# EAGLE design EchtzeitHat (EAGLE 9.3.0)
CREVISION: 2.1
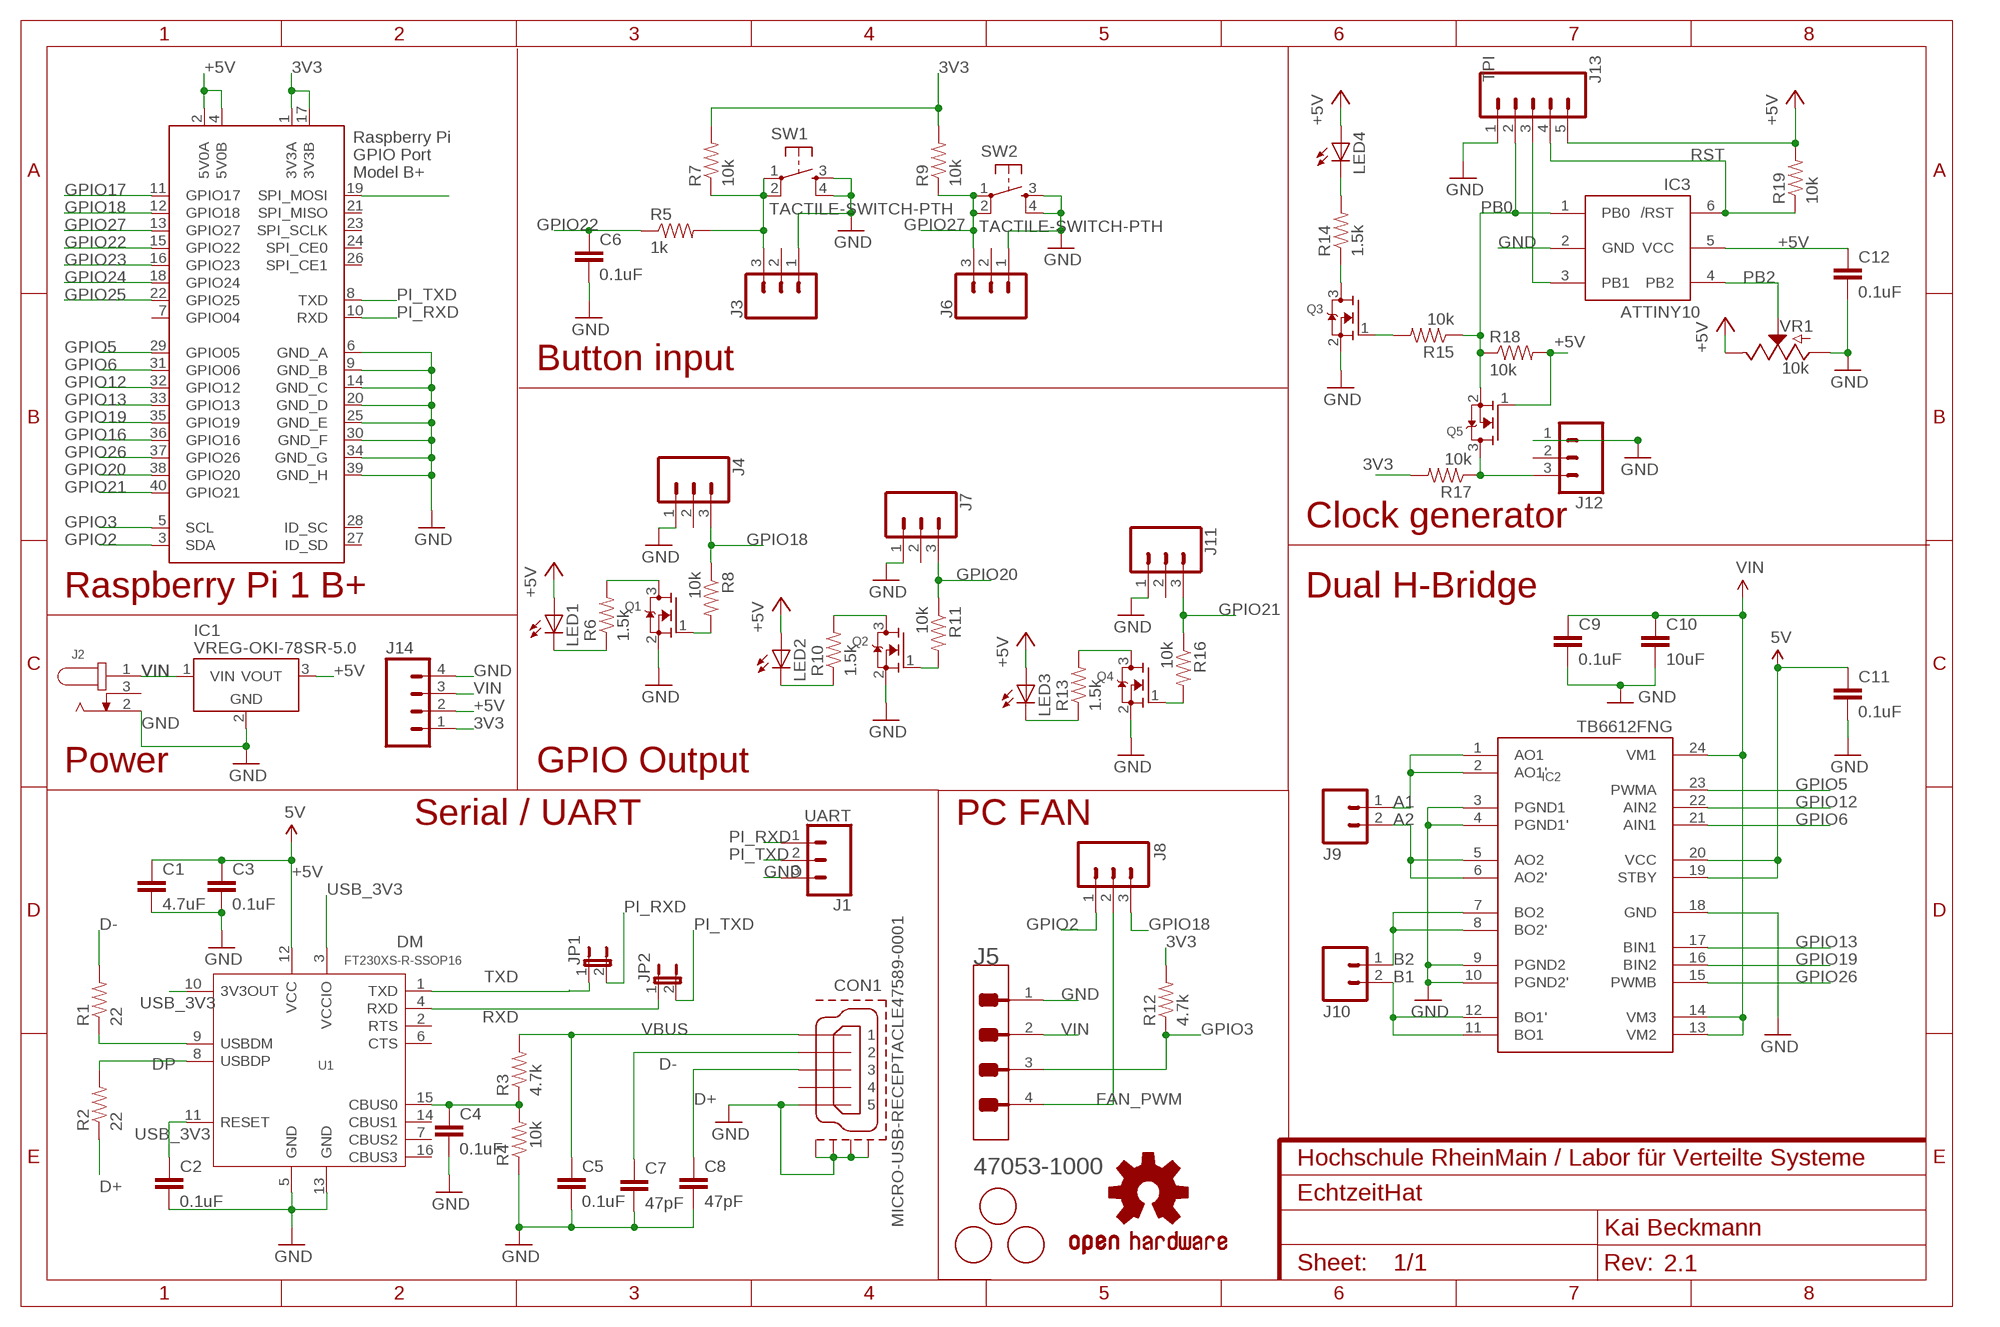
[diagram p0: schematic, sheet 1]
FRAME1 (FRAME-A4L): CNAME: Hochschule RheinMain / Labor für Verteilte Systeme; DESIGNER: Kai Beckmann

## Parts
C1  4.7uF  1.0UF-25V-+80/-20(0805)"  [0805-CAP]
C2  0.1uF  1.0UF-25V-+80/-20(0805)"  [0805-CAP]
C3  0.1uF  1.0UF-25V-+80/-20(0805)"  [0805-CAP]
C4  0.1uF  1.0UF-25V-+80/-20(0805)"  [0805-CAP]
C5  0.1uF  1.0UF-25V-+80/-20(0805)"  [0805-CAP]
C6  0.1uF  1.0UF-25V-+80/-20(0805)"  [0805-CAP]
C7  47pF  1.0UF-25V-+80/-20(0805)"  [0805-CAP]
C8  47pF  1.0UF-25V-+80/-20(0805)"  [0805-CAP]
C9  0.1uF  1.0UF-25V-+80/-20(0805)"  [0805-CAP]
C10  10uF  1.0UF-25V-+80/-20(0805)"  [0805-CAP]
C11  0.1uF  1.0UF-25V-+80/-20(0805)"  [0805-CAP]
C12  0.1uF  1.0UF-25V-+80/-20(0805)"  [0805-CAP]
CON1  MICRO-USB-RECEPTACLE47589-0001  [47589-0001]
FI1  FIDUCIAL  [FIDUCIAL_1MM]
FI2  FIDUCIAL  [FIDUCIAL_1MM]
FI3  FIDUCIAL  [FIDUCIAL_1MM]
IC1  VREG-OKI-78SR-5.0  VREG-OKI-78SR-5.0/1.5-W36H  [OKI-78SR-H]
IC2  TB6612FNG  [SSOP24]
IC3  ATTINY10  [SOT23-6]
J1  UART  CONN_03LOCK  [1X03_LOCK]
J2  PJ-102A  [CUI_PJ-102A]
J3  CONN_03LOCK  [1X03_LOCK]
J4  CONN_03LOCK  [1X03_LOCK]
J5  MOLEX_47053-1000MOLEX_47053-1000_0_0  [MOLEX_47053-1000_0]
J6  CONN_03LOCK  [1X03_LOCK]
J7  CONN_03LOCK  [1X03_LOCK]
J8  M03LOCK  [1X03_LOCK]
J9  M023.5MM_LOCK  [SCREWTERMINAL-3.5MM-2_LOCK]
J10  M023.5MM_LOCK  [SCREWTERMINAL-3.5MM-2_LOCK]
J11  CONN_03LOCK  [1X03_LOCK]
J12  CONN_03LOCK  [1X03_LOCK]
J13  TPI  CONN_05LOCK  [1X05_LOCK]
J14  M04LOCK  [1X04_LOCK]
JP1  JUMPER-2SMD-NC  [SJ_2S]
JP2  JUMPER-2SMD-NC  [SJ_2S]
LED1  LEDCHIPLED_0805  [CHIPLED_0805]
LED2  LEDCHIPLED_0805  [CHIPLED_0805]
LED3  LEDCHIPLED_0805  [CHIPLED_0805]
LED4  LEDCHIPLED_0805  [CHIPLED_0805]
LOGO1  OSHW-LOGOL  [OSHW-LOGO-L]
Q1  MOSFET-NREFLOW  [SOT23]
Q2  MOSFET-NREFLOW  [SOT23]
Q3  MOSFET-NREFLOW  [SOT23]
Q4  MOSFET-NREFLOW  [SOT23]
Q5  MOSFET-NREFLOW  [SOT23]
R1  22  0.22OHM-1/4W-1%(0805)  [0805]
R2  22  0.22OHM-1/4W-1%(0805)  [0805]
R3  4.7k  0.22OHM-1/4W-1%(0805)  [0805]
R4  10k  0.22OHM-1/4W-1%(0805)  [0805]
R5  1k  0.22OHM-1/4W-1%(0805)  [0805]
R6  1.5k  0.22OHM-1/4W-1%(0805)  [0805]
R7  10k  0.22OHM-1/4W-1%(0805)  [0805]
R8  10k  0.22OHM-1/4W-1%(0805)  [0805]
R9  10k  0.22OHM-1/4W-1%(0805)  [0805]
R10  1.5k  0.22OHM-1/4W-1%(0805)  [0805]
R11  10k  0.22OHM-1/4W-1%(0805)  [0805]
R12  4.7k  0.22OHM-1/4W-1%(0805)  [0805]
R13  1.5k  0.22OHM-1/4W-1%(0805)  [0805]
R14  1.5k  0.22OHM-1/4W-1%(0805)  [0805]
R15  10k  0.22OHM-1/4W-1%(0805)  [0805]
R16  10k  0.22OHM-1/4W-1%(0805)  [0805]
R17  10k  0.22OHM-1/4W-1%(0805)  [0805]
R18  10k  0.22OHM-1/4W-1%(0805)  [0805]
R19  10k  0.22OHM-1/4W-1%(0805)  [0805]
SW1  TACTILE-SWITCH-PTH  [TAC-SWITCH-PTH]
SW2  TACTILE-SWITCH-PTH  [TAC-SWITCH-PTH]
U1  FT230XS-R-SSOP16  INTERFACE-FT230XS-R(SSOP16)  [SSOP16-0.635-5X4MM]
VR1  10k  POTENTIOMETER-PTH-9MM-1/20W-20%-KIT  [POT-PTH-ALPS-KIT]
X1  RASPI_BOARD_B+#_H  [RASPI_BOARD_B+HAT]

## Nets
3V3: J14.1 R7.2 R9.2 R12.2 R17.2 X1.1(3V3A) X1.17(3V3B)
+5V: C1.1 C3.1 C11.1 C12.1 IC1.3(VOUT) IC2.19(STBY) IC2.20(VCC) IC3.5(VCC) J13.5 J14.2 LED1.A LED2.A LED3.A LED4.A Q5.1(G) R18.2 R19.2 U1.12(VCC) VR1.P$1(E) X1.2(5V0A) X1.4(5V0B) ; supply symbol labelled 5V
A1: IC2.1(AO1) IC2.2(AO1') J9.1
A2: IC2.5(AO2) IC2.6(AO2') J9.2
B1: IC2.11(BO1) IC2.12(BO1') J10.2
B2: IC2.7(BO2) IC2.8(BO2') J10.1
CBUS: C4.1 R3.1 R4.2 U1.15(CBUS0)
D+: C8.1 CON1.3 R2.1
D-: C7.1 CON1.2 R1.2
DM: R1.1 U1.9(USBDM)
DP: R2.2 U1.8(USBDP)
FAN_PWM: J5.4 J8.2
GND: C1.2 C2.2 C3.2 C4.2 C5.2 C6.2 C7.2 C8.2 C9.2 C10.2 C11.2 C12.2 CON1.5 CON1.CASING1(GND1) CON1.CASING2(GND2) CON1.CASING3(GND3) CON1.CASING4(GND4) IC1.2(GND) IC2.3(PGND1) IC2.4(PGND1') IC2.9(PGND2) IC2.10(PGND2') IC2.18(GND) IC3.2(GND) J1.3 J2.2 J3.1 J4.1 J5.1 J6.1 J7.1 J11.1 J12.1 J13.1 J14.4 Q1.2(S) Q2.2(S) Q3.2(S) Q4.2(S) R4.1 SW1.3 SW1.4 SW2.3 SW2.4 U1.5(GND) U1.13(GND) VR1.P$3(A) X1.6(GND_A) X1.9(GND_B) X1.14(GND_C) X1.20(GND_D) X1.25(GND_E) X1.30(GND_F) X1.34(GND_G) X1.39(GND_H)
GPIO2: J8.1 X1.3(SDA)
GPIO3: J5.3 R12.1 X1.5(SCL)
GPIO5: IC2.23(PWMA) X1.29(GPIO05)
GPIO6: IC2.21(AIN1) X1.31(GPIO06)
GPIO12: IC2.22(AIN2) X1.32(GPIO12)
GPIO13: IC2.17(BIN1) X1.33(GPIO13)
GPIO16: X1.36(GPIO16)
GPIO17: X1.11(GPIO17)
GPIO18: J4.3 J8.3 R8.1 X1.12(GPIO18)
GPIO19: IC2.16(BIN2) X1.35(GPIO19)
GPIO20: J7.3 R11.1 X1.38(GPIO20)
GPIO21: J11.3 R16.1 X1.40(GPIO21)
GPIO22: C6.1 R5.1 X1.15(GPIO22)
GPIO23: X1.16(GPIO23)
GPIO24: X1.18(GPIO24)
GPIO25: X1.22(GPIO25)
GPIO26: IC2.15(PWMB) X1.37(GPIO26)
GPIO27: J6.3 R9.1 SW2.1 SW2.2 X1.13(GPIO27)
N$2: LED1.C R6.1
N$3: IC3.3(PB1) J13.3
N$4: Q1.3(D) R6.2
N$6: Q1.1(G) R8.2
N$14: X1.19(SPI_MOSI)
N$17: LED4.C R14.2
N$18: Q3.3(D) R14.1
N$19: Q3.1(G) R15.2
N$20: J3.3 R5.2 R7.1 SW1.1 SW1.2
N$24: LED2.C R10.1
N$25: Q2.3(D) R10.2
N$26: Q2.1(G) R11.2
N$28: LED3.C R13.1
N$29: Q4.3(D) R13.2
N$30: Q4.1(G) R16.2
OSC: J12.3 Q5.3(D) R17.1
PB0: IC3.1(PB0) J13.2 Q5.2(S) R15.1 R18.1
PB2: IC3.4(PB2) VR1.P$2(S)
PI_RXD: J1.1 JP1.2 X1.10(RXD)
PI_TXD: J1.2 JP2.2 X1.8(TXD)
RST: IC3.6(/RST) J13.4 R19.1
RXD: JP2.1 U1.4(RXD)
TXD: JP1.1 U1.1(TXD)
USB_3V3: C2.1 U1.3(VCCIO) U1.10(3V3OUT) U1.11(RESET)
VBUS: C5.1 CON1.1 R3.2
VIN: C9.1 C10.1 IC1.1(VIN) IC2.13(VM2) IC2.14(VM3) IC2.24(VM1) J2.1 J5.2 J14.3
Unconnected: CON1.4 J2.3 J3.2 J4.2 J6.2 J7.2 J11.2 J12.2 U1.2(RTS) U1.6(CTS) U1.7(CBUS2) U1.14(CBUS1) U1.16(CBUS3) X1.7(GPIO04) X1.21(SPI_MISO) X1.23(SPI_SCLK) X1.24(SPI_CE0) X1.26(SPI_CE1) X1.27(ID_SD) X1.28(ID_SC)

## Notes on the sheet
- Button input
- Clock generator
- Raspberry Pi 1 B+ | Dual H-Bridge
- Power | GPIO Output
- Serial / UART | PC FAN

## Library data of the parts
C1-C12 = SparkFun-Capacitors:1.0UF-25V-+80/-20(0805): CAP-11625; PROD_ID: CAP-11625; VALUE: 1.0uF
CON1 = con-molex-usb:MICRO-USB-RECEPTACLE: MICRO USB RECEPTACLES Micro-USB Receptacles, SMT, Lead-Free from MOLEX <http://www.molex.com/>. (C) 2014 Tomasz Boleslaw CEDRO, cederom@tlen.pl, http://www.tomek.cedro.info. Version 0.1 (2014-01-17): Initial release. Version 0.2 (2014-02-06): Updated 47589-0001 footprint pins/pads/milling. Following devices are included: 1. 47589-0001 Micro-USB AB Receptacle, Bottom Mount, SMT, Lead-Free <http://www.molex.com/molex/products/datasheet.jsp?part=active/0475890001_IO_CONNECTORS.xml> (Technical Drawing <http://www.molex.com/pdm_docs/sd/475890001_sd.pdf>).
FI1-FI3 = adafruit:FIDUCIAL: For use by pick and place machines to calibrate the vision/machine, 1mm By microbuilder.eu
IC1 = we-power:VREG: Voltage Regulator LDOs Taiwan Semi TS1117 800mA max 15V - compatible On Semi NCP1117 1A max 20V - compatible Diodes AP2111H 0.6A max 6V (0.25V@0.6A) - compatible Diodes AP2114H 1A max 6V (0.45V@1A) Taiwan Semi TS9011 250mA max 12V - compatible Diodes AP2210 300mA max 15V - compatible Microchip MCP1700 250mA max 6.5V - compatible Microchip MCP1702 250mA max 13V - compatible Microchip MCP1703 250mA max 16V - compatible Microchip MCP1754 150mA max 16V Taiwan Semi TS5204 80mA max 16V (low noise) DC/DC Converter Modules Recom R-78Ex.x-1.0-W36 1A max 28V - compatible CUI V78xx-2000 2A max 18V Murata OKI-78SR-x.x/1.5-W36 1.5A max 36V
IC2 = adafruit:TB6612FNG: TB6612FNG MOS dual H-bridge motor driver, 1.2A current 3.2A peak 3 or 5v logic and 3-15v motor
IC3 = adafruit:ATTINY10: ATtiny4/5/9/10 8-bit Microcontroller with 512/1024 Bytes In-System Programmable Flash
J1 J3 J4 J6 J7 J11 J12 = SparkFun-Connectors:CONN_03: Multi connection point. Often used as Generic Header-pin footprint for 0.1 inch spaced/style header connections On any of the 0.1 inch spaced packages, you can populate with these: Break Away Headers - Straight <https://www.sparkfun.com/products/116> (PRT-00116) Break Away Male Headers - Right Angle <https://www.sparkfun.com/products/553> (PRT-00553) Female Headers <https://www.sparkfun.com/products/115> (PRT-00115) Break Away Headers - Machine Pin <https://www.sparkfun.com/products/117> (PRT-00117) Break Away Female Headers - Swiss Machine Pin <https://www.sparkfun.com/products/743> (PRT-00743) Stackable Header - 3 Pin (Female, 0.1") <https://www.sparkfun.com/products/13875> (PRT-13875) For SCREWTERMINALS and SPRING TERMINALS visit here: Screw Terimnals on SparkFun.com <https://www.sparkfun.com/search/results?term=Screw+Terminals> (5mm/3.5mm/2.54mm spacing) This device is also useful as a general connection point to wire up your design to another part of your project. Our various solder wires solder well into these plated through hole pads. Hook-Up Wire - Assortment (Stranded, 22 AWG) <https://www.sparkfun.com/products/11375> (PRT-11375) Hook-Up Wire - Assortment (Solid Core, 22 AWG) <https://www.sparkfun.com/products/11367> (PRT-11367) View the entire wire category on our website here <https://www.sparkfun.com/categories/141> Special notes: Molex polarized connector foot print use with SKU : PRT-08232 with associated crimp pins and housings.
J2 = PJ-102A:PJ-102A: 2.0 mm Center Pin, 2.5 A, Right Angle, Through Hole, Tapered Pins, Dc Power Jack Connector; MANUFACTURER: CUI INC; PART_REV: 1.03; STANDARD: Manufacturer recommendations
J5 = Molex - 47053-1000:MOLEX_47053-1000: 4-PIN HEADER HOUSING WITH FRICTION LOCK; CENTROID_NOT_SPECIFIED: Yes; CONTACT_TYPE: Male Pin; CURRENT: 4.0A; DATASHEET: http://www.molex.com/webdocs/datasheets/pdf/en-us//0470531000_PCB_HEADERS.pdf; DIGIKEY_DESCRIPTION: CONN 4 Positions Header, Unshrouded Connector 0.100" (2.54mm) Through Hole Tin; DIGIKEY_PART_NUMBER: WM4330-ND; IPC_LAND_PATTERN_NAME: HDRV4W65P_1X4_1020X65X1350; LEAD_FREE: yes; MF: Molex; MOUNTING_STYLE: Through Hole; MOUSER_PART_NUMBER: 538-47053-1000; MPN: 47053-1000; PACKAGE: CONN_4P254L; PITCH: 2.54mm; PREFIX: J; ROHS: yes; TEMPERATURE_RANGE_HIGH: +75°C; TEMPERATURE_RANGE_LOW: 0°C; VOLTAGE: 250V
J8 = SparkFun-Connectors:M03: Header 3 Standard 3-pin 0.1" header. Use with straight break away headers (SKU : PRT-00116), right angle break away headers (PRT-00553), swiss pins (PRT-00743), machine pins (PRT-00117), and female headers (PRT-00115). Molex polarized connector foot print use with SKU : PRT-08232 with associated crimp pins and housings.
J9 J10 = SparkFun-Connectors:M02: Standard 2-pin 0.1" header. Use with - straight break away headers ( PRT-00116) - right angle break away headers (PRT-00553) - swiss pins (PRT-00743) - machine pins (PRT-00117) - female headers (PRT-00115) Molex polarized connector foot print use with: PRT-08233 with associated crimp pins and housings. 2.54_SCREWTERM for use with PRT-10571. 3.5mm Screw Terminal footprints for PRT-08084 5mm Screw Terminal footprints for use with PRT-08432; PROD_ID: CONN-08399
J13 = SparkFun-Connectors:CONN_05: Multi connection point. Often used as Generic Header-pin footprint for 0.1 inch spaced/style header connections On any of the 0.1 inch spaced packages, you can populate with these: Break Away Headers - Straight <https://www.sparkfun.com/products/116> (PRT-00116) Break Away Male Headers - Right Angle <https://www.sparkfun.com/products/553> (PRT-00553) Female Headers <https://www.sparkfun.com/products/115> (PRT-00115) Break Away Headers - Machine Pin <https://www.sparkfun.com/products/117> (PRT-00117) Break Away Female Headers - Swiss Machine Pin <https://www.sparkfun.com/products/743> (PRT-00743) For SCREWTERMINALS and SPRING TERMINALS visit here: Screw Terimnals on SparkFun.com <https://www.sparkfun.com/search/results?term=Screw+Terminals> (5mm/3.5mm/2.54mm spacing) This device is also useful as a general connection point to wire up your design to another part of your project. Our various solder wires solder well into these plated through hole pads. Hook-Up Wire - Assortment (Stranded, 22 AWG) <https://www.sparkfun.com/products/11375> (PRT-11375) Hook-Up Wire - Assortment (Solid Core, 22 AWG) <https://www.sparkfun.com/products/11367> (PRT-11367) View the entire wire category on our website here <https://www.sparkfun.com/categories/141> Special notes: Molex polarized connector foot print use with SKU : PRT-08231 with associated crimp pins and housings. 1MM SMD Version SKU: PRT-10208
J14 = SparkFun-Connectors:M04: Header 4 Standard 4-pin 0.1" header. Use with straight break away headers (SKU : PRT-00116), right angle break away headers (PRT-00553), swiss pins (PRT-00743), machine pins (PRT-00117), and female headers (PRT-00115). Molex polarized connector foot print use with SKU : PRT-08231 with associated crimp pins and housings. 1MM SMD Version SKU: PRT-10208; PROD_ID: CONN-09696
JP1 JP2 = SparkFun-Retired:JUMPER-2: Jumper Basic 0.1" spaced jumper. Use with breakaway headers.
LED1-LED4 = adafruit:LED: LED OSRAM: - CHIPLED LG R971, LG N971, LY N971, LG Q971, LY Q971, LO R971, LY R971 LH N974, LH R974 LS Q976, LO Q976, LY Q976 LO Q996 - Hyper CHIPLED LW Q18S LB Q993, LB Q99A, LB R99A - SideLED LS A670, LO A670, LY A670, LG A670, LP A670 LB A673, LV A673, LT A673, LW A673 LH A674 LY A675 LS A676, LA A676, LO A676, LY A676, LW A676 LS A679, LY A679, LG A679 - Hyper Micro SIDELED® LS Y876, LA Y876, LO Y876, LY Y876 LT Y87S - SmartLED LW L88C, LW L88S LB L89C, LB L89S, LG L890 LS L89K, LO L89K, LY L89K LS L896, LA L896, LO L896, LY L896 - TOPLED LS T670, LO T670, LY T670, LG T670, LP T670 LSG T670, LSP T670, LSY T670, LOP T670, LYG T670 LG T671, LOG T671, LSG T671 LB T673, LV T673, LT T673, LW T673 LH T674 LS T676, LA T676, LO T676, LY T676, LB T676, LH T676, LSB T676, LW T676 LB T67C, LV T67C, LT T67C, LS T67K, LO T67K, LY T67K, LW E67C LS E67B, LA E67B, LO E67B, LY E67B, LB E67C, LV E67C, LT E67C LW T67C LS T679, LY T679, LG T679 LS T770, LO T770, LY T770, LG T770, LP T770 LB T773, LV T773, LT T773, LW T773 LH T774 LS E675, LA E675, LY E675, LS T675 LS T776, LA T776, LO T776, LY T776, LB T776 LHGB T686 LT T68C, LB T68C - Hyper Mini TOPLED® LB M676 - Mini TOPLED Santana® LG M470 LS M47K, LO M47K, LY M47K Source: http://www.osram.convergy.de/
LOGO1 = SparkFun-Aesthetics:OSHW-LOGO: Open Source Hardware Logo This logo indicates the piece of hardware it is found on incorporates a OSHW license and/or adheres to the definition of open source hardware found here: http://freedomdefined.org/OSHW
Q1-Q5 = adafruit:MOSFET-N: N-Channel Mosfet 2N7002E - 60V 260mA SOT23 [Digikey: 2N7002ET1GOSTR-ND] - REEL BSH103 - 30V 850mA SOT23 [Digikey: 568-5013-1-ND]
R1-R19 = SparkFun-Resistors:0.22OHM-1/4W-1%(0805): RES-09883; PROD_ID: RES-09883; VALUE: 0.22
SW1 SW2 = GeekAmmo:TACTILE-SWITCH: Tactile Switch 4 Pins, SPST NO
U1 = Seeed-IC:INTERFACE-FT230XS-R(SSOP16): 310070030; MPN: FT230XS-R
VR1 = SparkFun-Resistors:POTENTIOMETER: Potentiometer (Pot) Three-terminal potentiometers, with an adjustable wiper and two adjustable resistors. A pot can be used to create a configurable voltage divider, or as a variable resistor. Variants ALPS_POT and ALPS_POT_KIT - PTH, breadboard compatible, 9mm square pots Rotary Potentiometer - Linear (10k ohm) <https://www.sparkfun.com/products/9288> (COM-09288) The KIT variant exposes copper on only one side of the PTH pad, so the part can only be assembled on one side of the PCB. Useful for beginner soldering kits.; PROD_ID: RES-09177; SF_SKU: COM-09288
X1 = raspberrypi_bastelstube_v13:RASPI_BOARD_B+#: Raspberry Pi GPIO connector with markings for the outer dimensions of the Raspberry Pi board model B+ with different sets of drill holes or mounting pads All pins connected

## Board
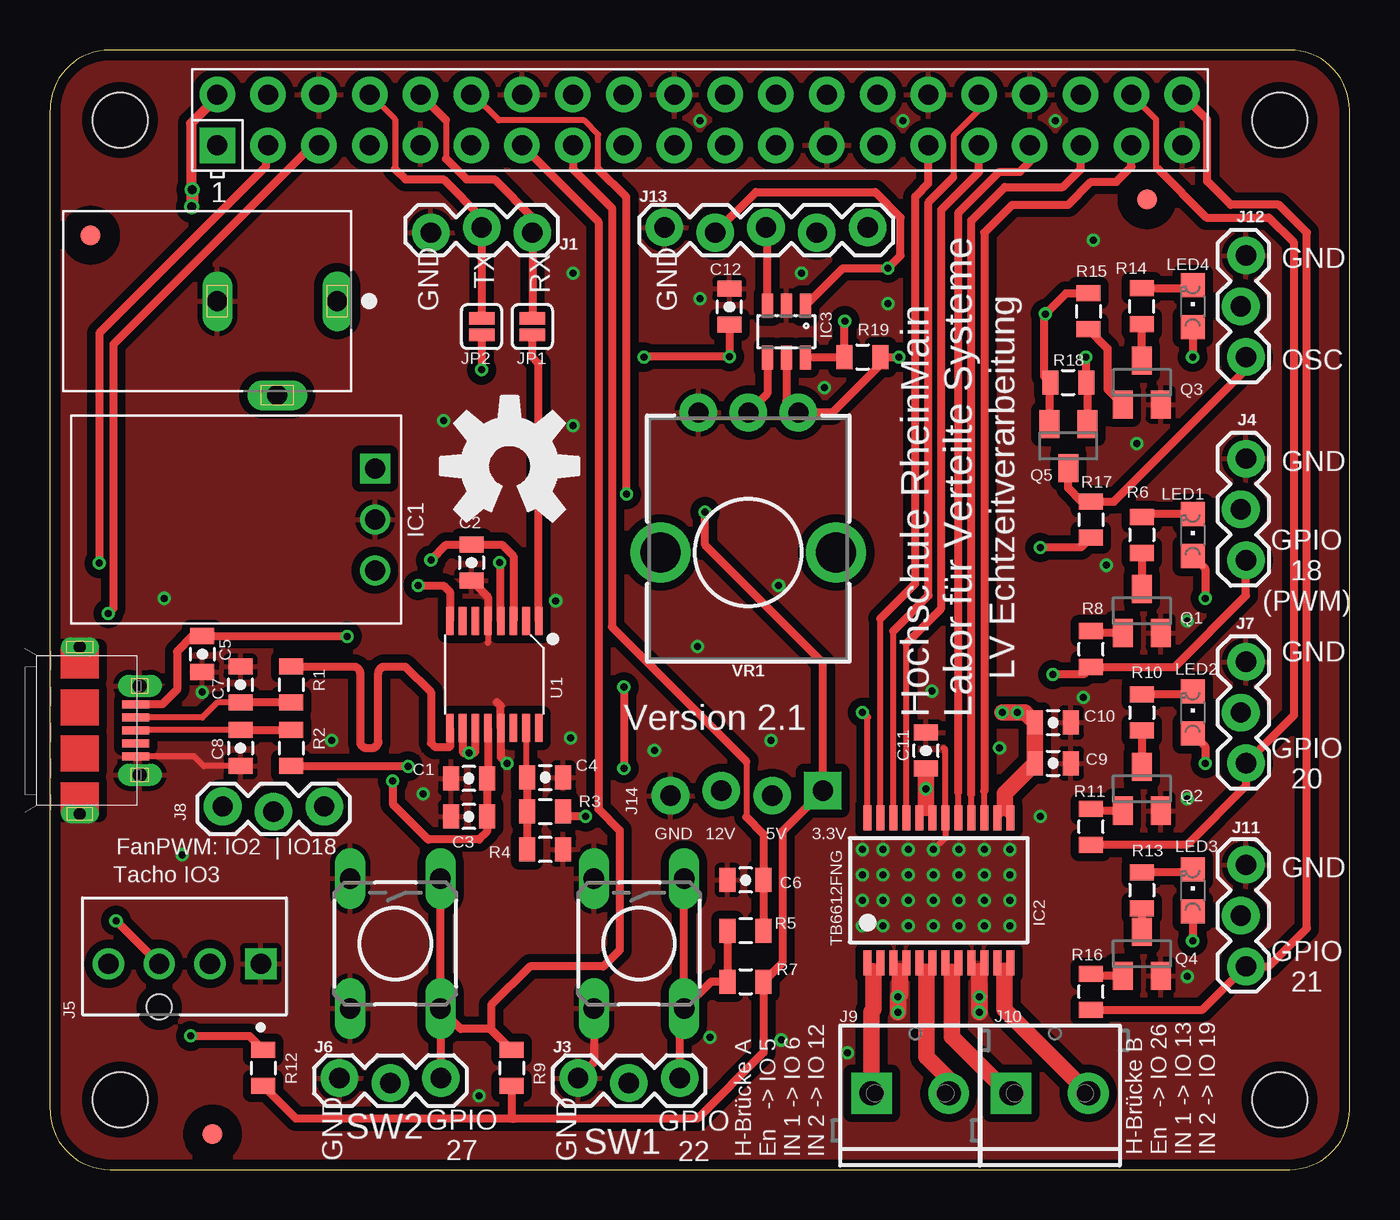
[diagram p1: board, top side]
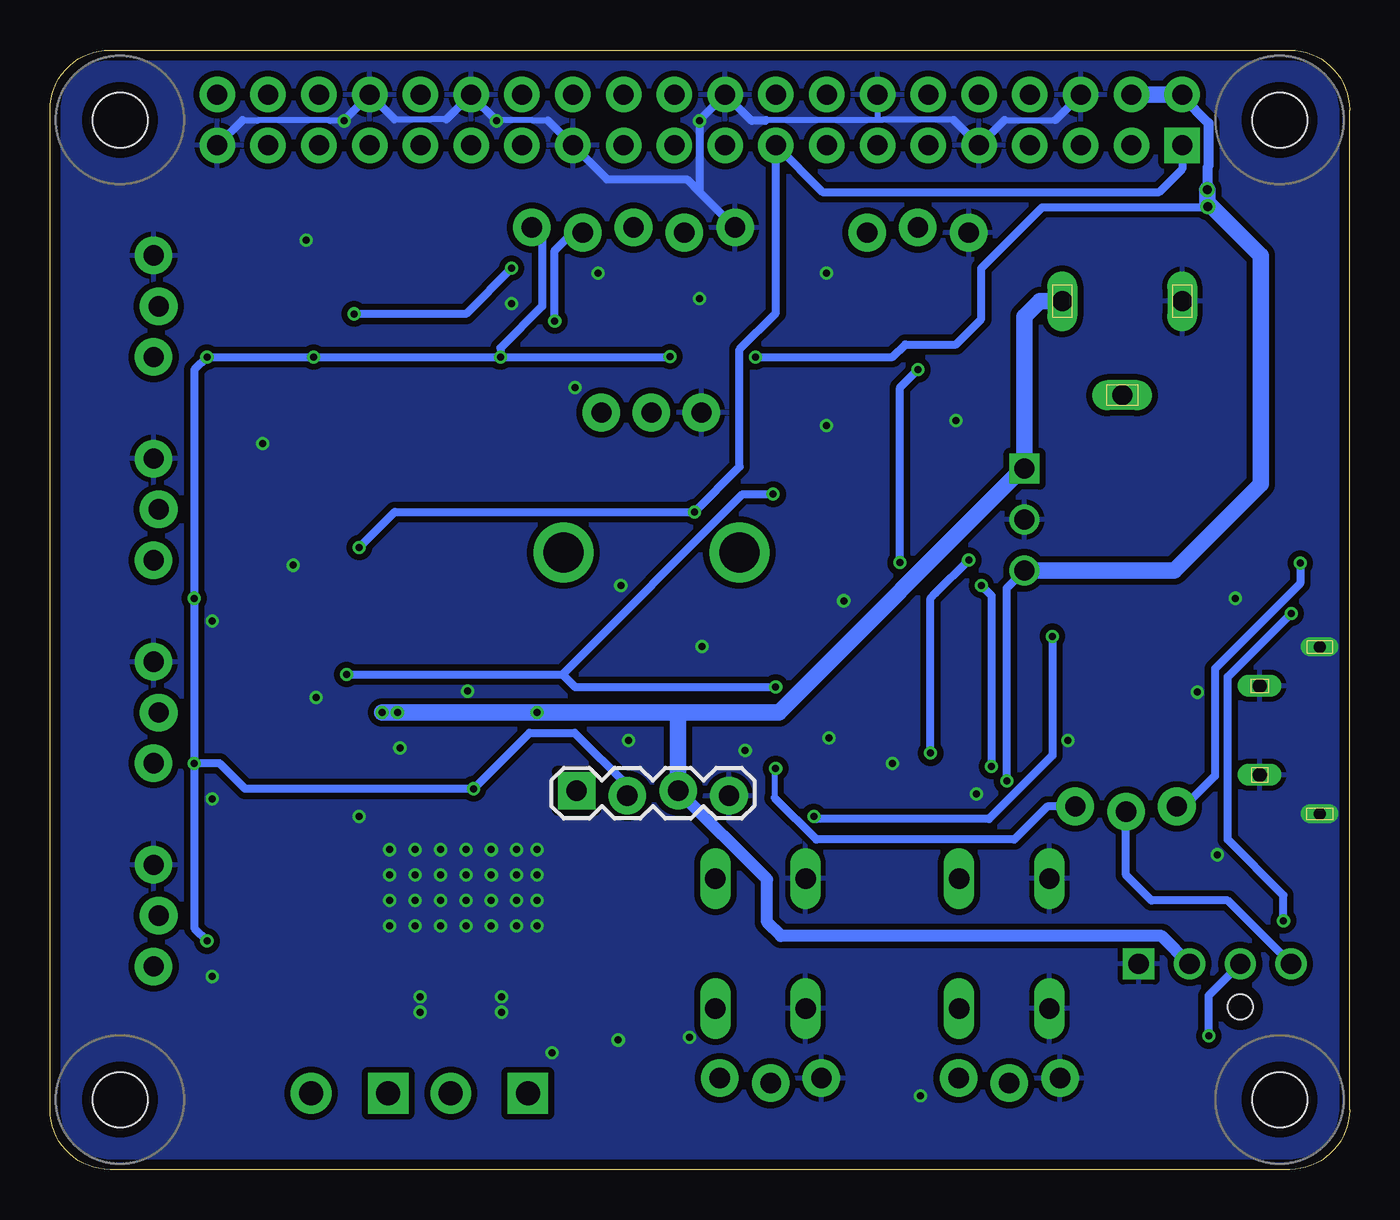
[diagram p2: board, bottom side, seen from below]

Size 65 x 56 mm. Coordinates in mm from the lower left corner, seen from the top.
Copper layers (1*16): Top 0.035mm / dielectric 1.6mm / Bottom 0.035mm
Design rules "Elecrow_2-layer_PCB_eagle_rule *": minimum track width 6mil, minimum drill 12mil, track to track 6mil, track to pad 6mil, pad to pad 6mil, via to via 8mil, smd to smd 0mil, copper to edge 20mil, drill to drill 10mil, minimum pad ring 6mil, minimum via ring 6mil, stop-mask expansion 0mil, vias tented up to drill 100mil, thermal gap 10mil

### Footprints (pad centres in the part's own frame; a part is rotated, then mirrored left to right if it is on the bottom)
0805-CAP = smd 0.8 x 1.2: 1 -0.9,0; 2 0.9,0
47589-0001 = smd 1.35 x 0.4: 1 2.8,1.3; 2 2.8,0.65; 3 2.8,0; 4 2.8,-0.65; 5 2.8,-1.3 | drill 0.6 pad 0.95 long: CASING1 0,4.175; CASING2 0,-4.175 | drill 0.7 pad 1.1 long: CASING3 3,2.225; CASING4 3,-2.225
FIDUCIAL_1MM = smd 1 x 1: 1 0,0
OKI-78SR-H = drill 1 pad 1.5 square: 1 -2.54,0 | drill 1 pad 1.5: 2 0,0; 3 2.54,0
SSOP24 = smd 0.4 x 1.25: 1 -3.575,-3.625; 2 -2.925,-3.625; 3 -2.275,-3.625; 4 -1.625,-3.625; 5 -0.975,-3.625; 6 -0.325,-3.625; 7 0.325,-3.625; 8 0.975,-3.625; 9 1.625,-3.625; 10 2.275,-3.625; 11 2.925,-3.625; 12 3.575,-3.625; 13 3.575,3.625; 14 2.925,3.625; 15 2.275,3.625; 16 1.625,3.625; 17 0.975,3.625; 18 0.325,3.625; 19 -0.325,3.625; 20 -0.975,3.625; 21 -1.625,3.625; 22 -2.275,3.625; 23 -2.925,3.625; 24 -3.575,3.625
SOT23-6 = smd 0.55 x 1.2: 1 -0.95,-1.3; 2 0,-1.3; 3 0.95,-1.3; 4 0.95,1.3; 5 0,1.3; 6 -0.95,1.3
1X03_LOCK = drill 1.016 pad 1.88: 1 0,0.127; 2 2.54,-0.127; 3 5.08,0.127
CUI_PJ-102A = drill 1 long: 1 -6.5,0; 2 -0.5,0; 3 -3.5,4.7
MOLEX_47053-1000_0 = drill 1.02 pad 1.57 square: 1 -0.38,-3.81 | drill 1.02 pad 1.57: 2 -0.38,-1.27; 3 -0.38,1.27; 4 -0.38,3.81 | hole 1.25: -2.54,1.27
SCREWTERMINAL-3.5MM-2_LOCK = drill 1.2 pad 2.032 square: 1 -0.178,0 | drill 1.2 pad 2.032: 2 3.678,0
1X05_LOCK = drill 1.016 pad 1.88: 1 0,0.127; 2 2.54,-0.127; 3 5.08,0.127; 4 7.62,-0.127; 5 10.16,0.127
1X04_LOCK = drill 1.016 pad 1.88 square: 1 0,0.127 | drill 1.016 pad 1.88: 2 2.54,-0.127; 3 5.08,0.127; 4 7.62,-0.127
SJ_2S = smd 0.635 x 1.27: 1 -0.412,0; 2 0.412,0
CHIPLED_0805 = smd 1.2 x 1.2: A 0,-1.05; C 0,1.05
SOT23 = smd 1 x 1.4: 1 -0.95,-1.1; 2 0.95,-1.1; 3 0,1.1
0805 = smd 0.8 x 1.2: 1 -0.9,0; 2 0.9,0
TAC-SWITCH-PTH = drill 1.016 pad 1.524 long: 1 -3.251,2.261; 2 3.251,2.261; 3 -3.251,-2.261; 4 3.251,-2.261
SSOP16-0.635-5X4MM = smd 0.381 x 1.397: 1 -2.223,-2.667; 2 -1.587,-2.667; 3 -0.953,-2.667; 4 -0.318,-2.667; 5 0.318,-2.667; 6 0.953,-2.667; 7 1.587,-2.667; 8 2.223,-2.667; 9 2.223,2.667; 10 1.587,2.667; 11 0.953,2.667; 12 0.318,2.667; 13 -0.318,2.667; 14 -0.953,2.667; 15 -1.587,2.667; 16 -2.223,2.667
POT-PTH-ALPS-KIT = drill 1 pad 1.88: P$1 7,-2.5; P$2 7,0; P$3 7,2.5 | drill 2: P$4 0,-4.4; P$5 0,4.4
RASPI_BOARD_B+HAT = drill 1 pad 1.778 square: 1 8.37,51.23 | drill 1 pad 1.778: 2 8.37,53.77; 3 10.91,51.23; 4 10.91,53.77; 5 13.45,51.23; 6 13.45,53.77; 7 15.99,51.23; 8 15.99,53.77; 9 18.53,51.23; 10 18.53,53.77; 11 21.07,51.23; 12 21.07,53.77; 13 23.61,51.23; 14 23.61,53.77; 15 26.15,51.23; 16 26.15,53.77; 17 28.69,51.23; 18 28.69,53.77; 19 31.23,51.23; 20 31.23,53.77; 21 33.77,51.23; 22 33.77,53.77; 23 36.31,51.23; 24 36.31,53.77; 25 38.85,51.23; 26 38.85,53.77; 27 41.39,51.23; 28 41.39,53.77; 29 43.93,51.23; 30 43.93,53.77; 31 46.47,51.23; 32 46.47,53.77; 33 49.01,51.23; 34 49.01,53.77; 35 51.55,51.23; 36 51.55,53.77; 37 54.09,51.23; 38 54.09,53.77; 39 56.63,51.23; 40 56.63,53.77 | hole 2.75: 3.5,3.5; 3.5,52.5; 61.5,3.5; 61.5,52.5

### Placement (x,y rotation side)
C1  20.95,19.56 180 top
C2  21.08,30.35 270 top
C3  20.95,17.65 180 top
C4  24.77,19.61 0 top
C5  7.62,25.78 270 top
C6  34.8,14.48 180 top
C7  9.53,24.26 90 top
C8  9.53,21.08 270 top
C9  50.16,20.32 0 top
C10  50.16,22.35 0 top
C11  43.81,20.95 90 top
C12  33.99,43.15 90 top
CON1  1.5,21.97 0 top
FI1  54.86,48.51 0 top
FI2  8.13,1.78 0 top
FI3  2.03,46.74 0 top
IC1  16.26,32.51 270 top
IC2  44.45,13.97 0 top
IC3  36.83,41.91 180 top
J1  24.13,46.99 180 top
J2  7.87,43.43 180 top
J3  26.42,4.45 0 top
J4  59.69,35.56 270 top
J5  6.73,10.67 90 top
J6  14.48,4.45 0 top
J7  59.69,25.4 270 top
J8  8.64,18.03 0 top
J9  41.27,3.81 0 top
J10  48.26,3.81 0 top
J11  59.69,15.24 270 top
J12  59.69,45.72 270 top
J13  30.73,46.99 0 top
J14  38.66,18.82 0 bottom
JP1  24.13,42.16 90 top
JP2  21.59,42.16 90 top
LED1  57.15,31.75 0 top
LED2  57.15,22.86 0 top
LED3  57.15,13.97 0 top
LED4  57.15,43.18 0 top
LOGO1  22.99,35.18 0 top
Q1  54.61,27.94 0 top
Q2  54.61,19.05 0 top
Q3  54.61,39.37 0 top
Q4  54.61,10.79 0 top
Q5  50.93,36.2 180 top
R1  12.06,24.26 270 top
R2  12.06,21.08 270 top
R3  24.77,17.91 0 top
R4  24.77,16 180 top
R5  34.8,11.94 180 top
R6  54.61,31.75 270 top
R7  34.8,9.4 0 top
R8  52.07,26.04 90 top
R9  23.09,5.08 270 top
R10  54.61,22.86 270 top
R11  52.07,17.14 90 top
R12  10.67,5.08 270 top
R13  54.61,13.97 270 top
R14  54.61,43.18 90 top
R15  51.94,42.93 270 top
R16  52.07,8.89 90 top
R17  52.07,32.51 270 top
R18  50.93,39.37 0 top
R19  40.64,40.64 0 top
SW1  29.46,11.3 270 top
SW2  17.27,11.3 270 top
U1  22.23,24.77 180 top
VR1  34.92,30.86 90 top
X1  0,0 0 top

### Tracks (layer width: path | path; a pad name or v marks a point on that pad's centre or on a via)
3V3  (via drill 0.35)
  Top 0.406: R17.2 51.57,31.11 v49.53,31.11 | R9.2 23.09,2.54 | 23.09,2.54 22.61,2.54 12.31,2.54 R12.2 | v32.77,32.89 32.77,31.24 38.66,25.35 J14.1 36.63,16.92 36.63,10.33 R7.2 35.7,5.85 32.38,2.54 23.37,2.54 23.24,2.54 23.09,2.54
  Bottom 0.406: v49.53,31.11 47.75,32.89 v32.77,32.89 30.5,35.15 30.5,41.03 28.69,42.85 X1.17 26.36,48.9 9.53,48.9 8.37,50.05 X1.1
+5V  (via drill 0.35, 0.45)
  Top 0.305: IC2.20 43.48,17.75 43.81,18.09 44.12,17.77 IC2.19
  Top 0.406: Q5.1 51.88,39.32 R18.2 51.83,40.63 v51.82,40.64 | LED4.A v57.15,40.64 | LED1.A 57.78,30.07 v57.78,28.57 | LED2.A 57.78,21.18 v57.78,20.32 | LED3.A v57.15,11.43 | IC3.5 36.83,38.46 VR1.P$1 39.13,37.86 41.54,40.27 R19.2 v42.47,40.64 | C12.1 v33.98,40.66 29.74,40.66 v29.72,40.64 | U1.12 21.91,19.61 C1.1 C3.1 21.86,16.89 21.47,16.51 18.92,16.51 17.14,18.29 v17.14,19.43
  Top 0.508: X1.2 8.37,53.64 7.06,52.33 7.06,49.07 v7.11,49.02
  Top 0.61: v7.11,49.02 7.11,48.18 v7.09,48.16
  Top 0.813: 43.81,18.09 v43.81,19.05 C11.1
  Bottom 0.406: v57.78,20.32 v57.78,28.57 57.78,40.01 v57.15,40.64 v51.82,40.64 v42.47,40.64 | v57.78,20.32 57.78,12.06 v57.15,11.43 | v29.72,40.64 22.86,40.64 22.23,41.27 19.68,41.27 18.41,42.55 18.41,45.09 15.37,48.13 7.37,48.13 7.11,48.39 | IC1.3 17.14,29.08 v17.14,19.43 | v57.78,20.32 56.52,20.32 55.24,19.05 v43.81,19.05 41.02,21.84 38.76,21.84 36.12,19.2 J14.2 | v42.47,40.64 34.01,40.64 v33.98,40.66 | J13.5 40.39,46.61 40.39,43.18 42.47,41.1 v42.47,40.64
  Bottom 0.508: 8.37,53.66 7.06,52.35 7.08,52.34 7.08,50.17 7.11,50.13 v7.11,49.02
  Bottom 0.61: X1.2 8.37,53.66
  Bottom 0.813: X1.4 X1.2 | IC1.3 8.76,29.97 4.45,34.29 4.45,45.72 7.11,48.39 v7.11,49.02
A1
  Top 0.305: IC2.2 41.52,10.23 41.2,9.91 40.88,10.23 IC2.1
  Top 0.813: J9.1 41.1,7.9 41.2,8 41.2,9.91
A2
  Top 0.305: IC2.6 44.12,10.19 43.83,9.89 43.83,9.99 IC2.5
  Top 0.813: J9.2 44.95,4.51 43.83,5.63 43.83,9.89
B1
  Top 0.305: IC2.12 48.02,10.23 47.73,9.93 47.38,10.28 IC2.11
  Top 0.813: J10.2 47.73,8.02 47.73,9.93
B2
  Top 0.305: IC2.8 45.42,10.2 45.11,9.88 44.77,10.22 IC2.7
  Top 0.813: J10.1 47.94,3.81 45.11,6.64 45.11,9.88
CBUS
  Top 0.305: U1.15 23.81,19.66 C4.1
  Top 0.406: R4.2 23.81,16.05 23.86,16.11 R3.1 C4.1
D+
  Top 0.305: C8.1 4.31,21.98 CON1.3
  Top 0.406: C8.1 R2.1
D-
  Top 0.305: CON1.2 4.31,22.61 7.62,22.61 8.37,23.36 C7.1
  Top 0.406: R1.2 C7.1
DM
  Top 0.406: U1.9 20,21.14 19.24,21.14 19.05,21.34 19.05,23.88 17.77,25.16 16.76,25.16 arc90 16.42,24.81 16.42,21.42 arc-90 16.08,21.08 15.86,21.08 arc-90 15.51,21.42 15.51,24.81 arc90 15.17,25.16 R1.1
DP  (via drill 0.35)
  Top 0.406: v17.91,20.17 17.89,20.18 R2.2 | U1.8 20,28.89 19.68,29.21 v18.41,29.21
  Bottom 0.406: v18.41,29.21 17.91,28.7 v17.91,20.17
FAN_PWM
  Bottom 0.406: J5.4 6.09,13.46 9.91,13.46 11.18,14.73 J8.2
GND  (via drill 0.35)
  Top 0.305: v44.2,16 44.77,16.58 IC2.18 44.77,21.01 44.7,21.08 | U1.5 21.91,26.35 | CON1.5 7.21,20.67 7.7,20.18 C8.2 | IC2.10 46.48,10.1 46.48,9.86 46.08,10.26 IC2.9 | IC2.4 42.83,10.21 42.52,9.91 42.17,10.25 IC2.3
  Top 0.406: v22.86,20.32 22.54,20.64 U1.13 22.54,23.18 22.35,23.37 | SW1.4 27.2,5.36 J3.1 | C2.2 21.91,28.63 U1.5
  Top 0.813: v42.42,7.87 v42.42,8.64 42.52,8.74 42.52,9.91 | v46.48,7.87 v46.48,8.64 46.48,9.86 46.43,9.91
  Bottom 0.305: 17.26,52.5 14.72,52.5 | 23.5,52.5 23.37,52.5 19.8,52.5 | 23.5,52.5 29.18,52.5 | 40.09,52.48 40.87,52.48 42.65,52.48 v42.67,52.45 | 45.17,52.52 45.95,52.52 47.76,52.52 47.77,52.52 | 55.37,52.49 55.34,52.45 54.63,52.45 54.61,52.48 51.03,52.48 51.01,52.45 v50.29,52.45 | X1.14 23.61,52.62 23.5,52.5
  Bottom 0.406: 32.51,48.9 v32.51,52.45 32.51,52.49 X1.20 29.91,52.45 29.23,52.45 29.18,52.5 | 32.51,48.9 33.15,49.53 37.15,49.53 X1.25 40.09,52.48 | 32.51,48.9 J13.1 | v50.29,52.45 50.29,52.49 X1.34 47.77,52.52 | 45.17,52.52 X1.30 43.93,53.71 v42.67,52.45 | 55.37,52.49 X1.39 | 17.26,52.5 X1.9 19.8,52.5 | 14.72,52.5 X1.6
  other vias: 19.68,37.47 26.04,21.59 7.62,23.88 56.9,27.43 56.9,18.54 56.9,9.65 49.53,17.65 51.69,23.62 44.12,23.93 54.36,36.32 26.16,44.83 26.16,37.21 33.02,6.6 52.83,30.23 14.1,21.46 52.2,46.48 37.59,44.83 32.51,43.56 47.5,21.08 41.91,43.31 36.45,29.21 21.46,3.68 5.71,28.57 39.88,5.84 25.3,28.45 38.73,39.12 40.64,16 41.66,16 40.64,12.19 44.2,12.19 48.01,12.19 48.01,13.46 46.74,13.46 45.47,13.46 44.2,13.46 42.93,13.46 41.66,13.46 40.64,13.46 40.64,14.73 41.66,14.73 42.93,14.73 44.2,14.73 45.47,14.73 46.74,14.73 48.01,14.73 48.01,16 46.74,16 45.47,16 42.93,16 32.38,26.16 18.67,18.8 6.6,15.75 36.58,6.48 30.23,20.95 36.07,21.46 41.66,12.19 42.93,12.19 45.47,12.19 46.74,12.19
  pour Top (isolate 0.406): -1.27,-1.27 66.04,-1.27 66.04,57.02 -1.27,57.02
  pour Bottom (isolate 0.305): -0.64,-0.64 65.41,-0.64 65.41,56.39 -0.64,56.39
GPIO2  (via drill 0.35)
  Top 0.406: v2.46,30.33 2.46,41.83 10.79,50.16 10.79,51.12 X1.3
  Bottom 0.406: v2.46,30.33 2.46,29.31 6.73,25.04 6.73,19.68 8.26,18.16 J8.1
GPIO3  (via drill 0.35)
  Top 0.406: X1.5 13.13,51.23 3.17,41.27 3.17,28.07 v2.92,27.81 | R12.1 9.97,6.68 v7.04,6.68 | J5.3 v3.3,12.45
  Bottom 0.406: v7.04,6.68 7.05,6.7 7.05,8.7 J5.3 | v2.92,27.81 6.1,24.64 6.1,16.51 3.3,13.72 v3.3,12.45
GPIO5
  Top 0.305: IC2.23 41.52,27.55
  Top 0.406: X1.29 43.93,49.33 43.28,48.67 43.28,29.31 41.52,27.55
GPIO6
  Top 0.305: IC2.21 42.83,26.32
  Top 0.406: X1.31 46.47,49.9 44.58,48.01 44.58,28.07 42.83,26.32
GPIO12
  Top 0.305: IC2.22 42.17,26.93 | 45.17,49.62 45.22,49.67 45.22,51.75 46.47,52.99 X1.32
  Top 0.406: 45.17,49.62 43.94,48.39 43.94,28.7 42.17,26.93
GPIO13
  Top 0.305: IC2.17 45.42,18.89
  Top 0.406: 45.42,18.89 45.41,18.88 45.41,47.83 47.5,49.91 48.51,49.91 49.01,50.41 X1.33
GPIO18  (via drill 0.35)
  Top 0.305: 27.42,50.05 27.42,51.77 26.71,52.48 22.45,52.48 21.16,53.77 X1.12
  Top 0.406: J4.3 59.82,28.7 56.25,25.14 R8.1 51.7,24.77 v50.16,24.77 | 27.42,50.05 28.83,48.64 v28.83,33.78 | v28.7,24.13 v28.7,20.07
  Bottom 0.305: v28.7,20.07 28.75,20.07 28.75,18.59
  Bottom 0.406: v50.16,24.77 39.37,24.77 | 39.37,24.77 30.35,33.78 v28.83,33.78 | J8.3 15.11,18.16 16.76,16.51 26.67,16.51 28.75,18.59 | 39.37,24.77 38.73,24.13 v28.7,24.13
GPIO19
  Top 0.305: IC2.16 46.08,18.76
  Top 0.406: 46.08,18.76 46.08,47.47 47.75,49.15 50.67,49.15 51.55,50.03 X1.35
GPIO20
  Top 0.305: 55.38,50.08 55.34,50.13 55.34,52.52 X1.38
  Top 0.406: 55.38,50.08 57.84,47.62 60.96,47.62 62.23,46.35 62.23,22.73 J7.3 59.82,19.18 56.88,16.25 R11.1
GPIO21
  Top 0.406: X1.40 57.89,52.51 57.89,49.43 59.05,48.26 61.47,48.26 62.87,46.86 62.87,12.06 60.96,10.16 J11.3 57.65,7.99 R16.1
GPIO22
  Top 0.305: 34.83,20.41 34.83,17.63
  Top 0.406: X1.15 26.15,50.05 28.1,48.1 28.1,27.14 34.83,20.41 | 34.83,17.63 35.7,16.76 C6.1 R5.1
GPIO26
  Top 0.305: IC2.15 46.73,18.92
  Top 0.406: 46.73,18.92 46.74,18.93 46.74,46.86 48.13,48.26 50.93,48.26 52.07,49.4 53.34,49.4 54.09,50.15 X1.37
GPIO27
  Top 0.406: SW2.2 20.55,7.04 22.03,7.04 R9.1 22.07,7 22.07,8.23 24,10.16 27.69,10.16 28.5,10.97 28.5,16.97 27.43,18.03 27.43,47.41 X1.13 | SW2.2 SW2.1 | SW2.2 19.53,4.6 J6.3
N$2
  Top 0.406: LED1.C 54.76,32.8 R6.1
N$3
  Top 0.406: IC3.3 35.88,47.05 J13.3
N$4
  Top 0.406: R6.2 Q1.3
N$6
  Top 0.406: Q1.1 52.16,26.84 R8.2
N$17
  Top 0.406: R14.2 57,44.08 LED4.C
N$18
  Top 0.406: Q3.3 R14.1
N$19
  Top 0.406: Q3.1 52.9,39.03 52.9,41.07 R15.2
N$20
  Top 0.406: R5.2 R7.1 33.07,9.4 SW1.2 | SW1.2 SW1.1 | SW1.2 31.98,8.31 31.98,8.36 31.5,7.87 J3.3
N$24
  Top 0.406: LED2.C 57,23.76 R10.1
N$25
  Top 0.406: R10.2 Q2.3
N$26
  Top 0.406: Q2.1 52.16,17.95 R11.2
N$28
  Top 0.406: LED3.C 57,14.87 R13.1
N$29
  Top 0.406: R13.2 Q4.3
N$30
  Top 0.406: Q4.1 52.16,9.7 R16.2
OSC
  Top 0.406: J12.3 59.82,40.01 53.22,33.41 R17.1 51.59,33.41 50.93,34.08 Q5.3
PB0  (via drill 0.35)
  Top 0.406: Q5.2 49.98,39.32 R18.1 49.72,39.67 49.72,42.74 v49.78,42.8 50.8,43.81 51.93,43.81 R15.1 | J13.2 35.31,48.9 41.27,48.9 42.55,47.62 42.55,45.72 v41.91,45.09 39.66,45.09 IC3.1
  Bottom 0.406: v41.91,45.09 44.2,42.8 v49.78,42.8
PB2
  Top 0.406: IC3.4 35.88,38.82 VR1.P$2
PI_RXD
  Top 0.305: 19.8,52.5 19.8,50.56
  Top 0.406: JP1.2 J1.1 24.13,47.62 22.23,49.53 20.83,49.53 19.8,50.56 | X1.10 19.8,52.5
PI_TXD
  Top 0.305: 17.26,50.05 17.26,52.53 16.02,53.77 X1.8
  Top 0.406: JP2.2 J1.2 21.59,47.62 19.68,49.53 17.78,49.53 17.26,50.05
RST  (via drill 0.35)
  Top 0.406: IC3.6 37.81,40.64 R19.1 v39.74,42.43 v39.75,42.44
  Bottom 0.406: v39.75,42.44 39.75,45.97 38.86,46.86 J13.4
RXD  (via drill 0.35)
  Top 0.406: U1.4 22.54,30.29 v22.48,30.35 | JP2.1 v21.59,40.01
  Bottom 0.406: v22.48,30.35 22.48,39.12 v21.59,40.01
TXD
  Top 0.406: U1.1 24.45,40.32 24.13,40.64 JP1.1
USB_3V3  (via drill 0.35)
  Top 0.406: U1.10 20.64,20.89 20.7,20.83 v20.95,20.83 21.21,20.83 21.27,20.89 U1.11 | U1.3 23.18,30.68 22.61,31.25 C2.1 19.82,31.25 v19.05,30.48
  Bottom 0.406: v19.05,30.48 20.7,28.83 20.95,28.57 v20.95,20.83
VBUS  (via drill 0.35)
  Top 0.406: v14.86,26.67 14.85,26.68 C5.1 7.12,26.68 6.35,25.91 6.35,24 5.62,23.27 CON1.1 | v26.8,17.65 25.92,17.65 R3.2
  Bottom 0.406: v26.8,17.65 26.67,17.53 18.03,17.53 14.86,20.7 v14.86,26.67
VIN  (via drill 0.35)
  Top 0.305: IC2.24 40.88,22.62 | 47.76,17.98 47.76,17.86 IC2.13 | 47.76,18.09 47.76,17.98 | 47.76,17.98 IC2.14
  Top 0.406: 40.88,22.62 v40.64,22.86 | 47.76,18.09 47.6,17.93 47.69,17.93
  Top 0.813: v47.62,22.86 48.76,22.86 C10.1 C9.1 47.76,18.82 47.76,18.09
  Bottom 0.61: J5.2 9.4,11.68 28.45,11.68 29.13,12.37 29.13,14.5 J14.3
  Bottom 0.813: 33.38,22.86 v40.64,22.86 v47.62,22.86 v48.39,22.86 | 33.38,22.86 28.55,22.86 16.36,35.05 IC1.1 16.26,42.66 15.49,43.43 J2.1 | J14.3 33.58,22.66 33.38,22.86

### Text on the board
tNames: GND | TX | RX | GND | GND | OSC | GND | GPIO / 18 / (PWM) | LV Echtzeitverarbeitung | GND | Version 2.1 | Hochschule RheinMain / Labor für Verteilte Systeme | GPIO / 20 | GND | 12V | 5V | 3.3V | FanPWM: IO2 | IO18 | GND | Tacho IO3 | TB6612FNG | GPIO / 21 | H-Brücke A / En -> IO 5 / IN 1 -> IO 6 / IN 2 -> IO 12 | H-Brücke B / En -> IO 26 / IN 1 -> IO 13 / IN 2 -> IO 19 | GND | GPIO / 27 | GND | GPIO / 22